# EAGLE design drivessop (EAGLE 6.6.0)
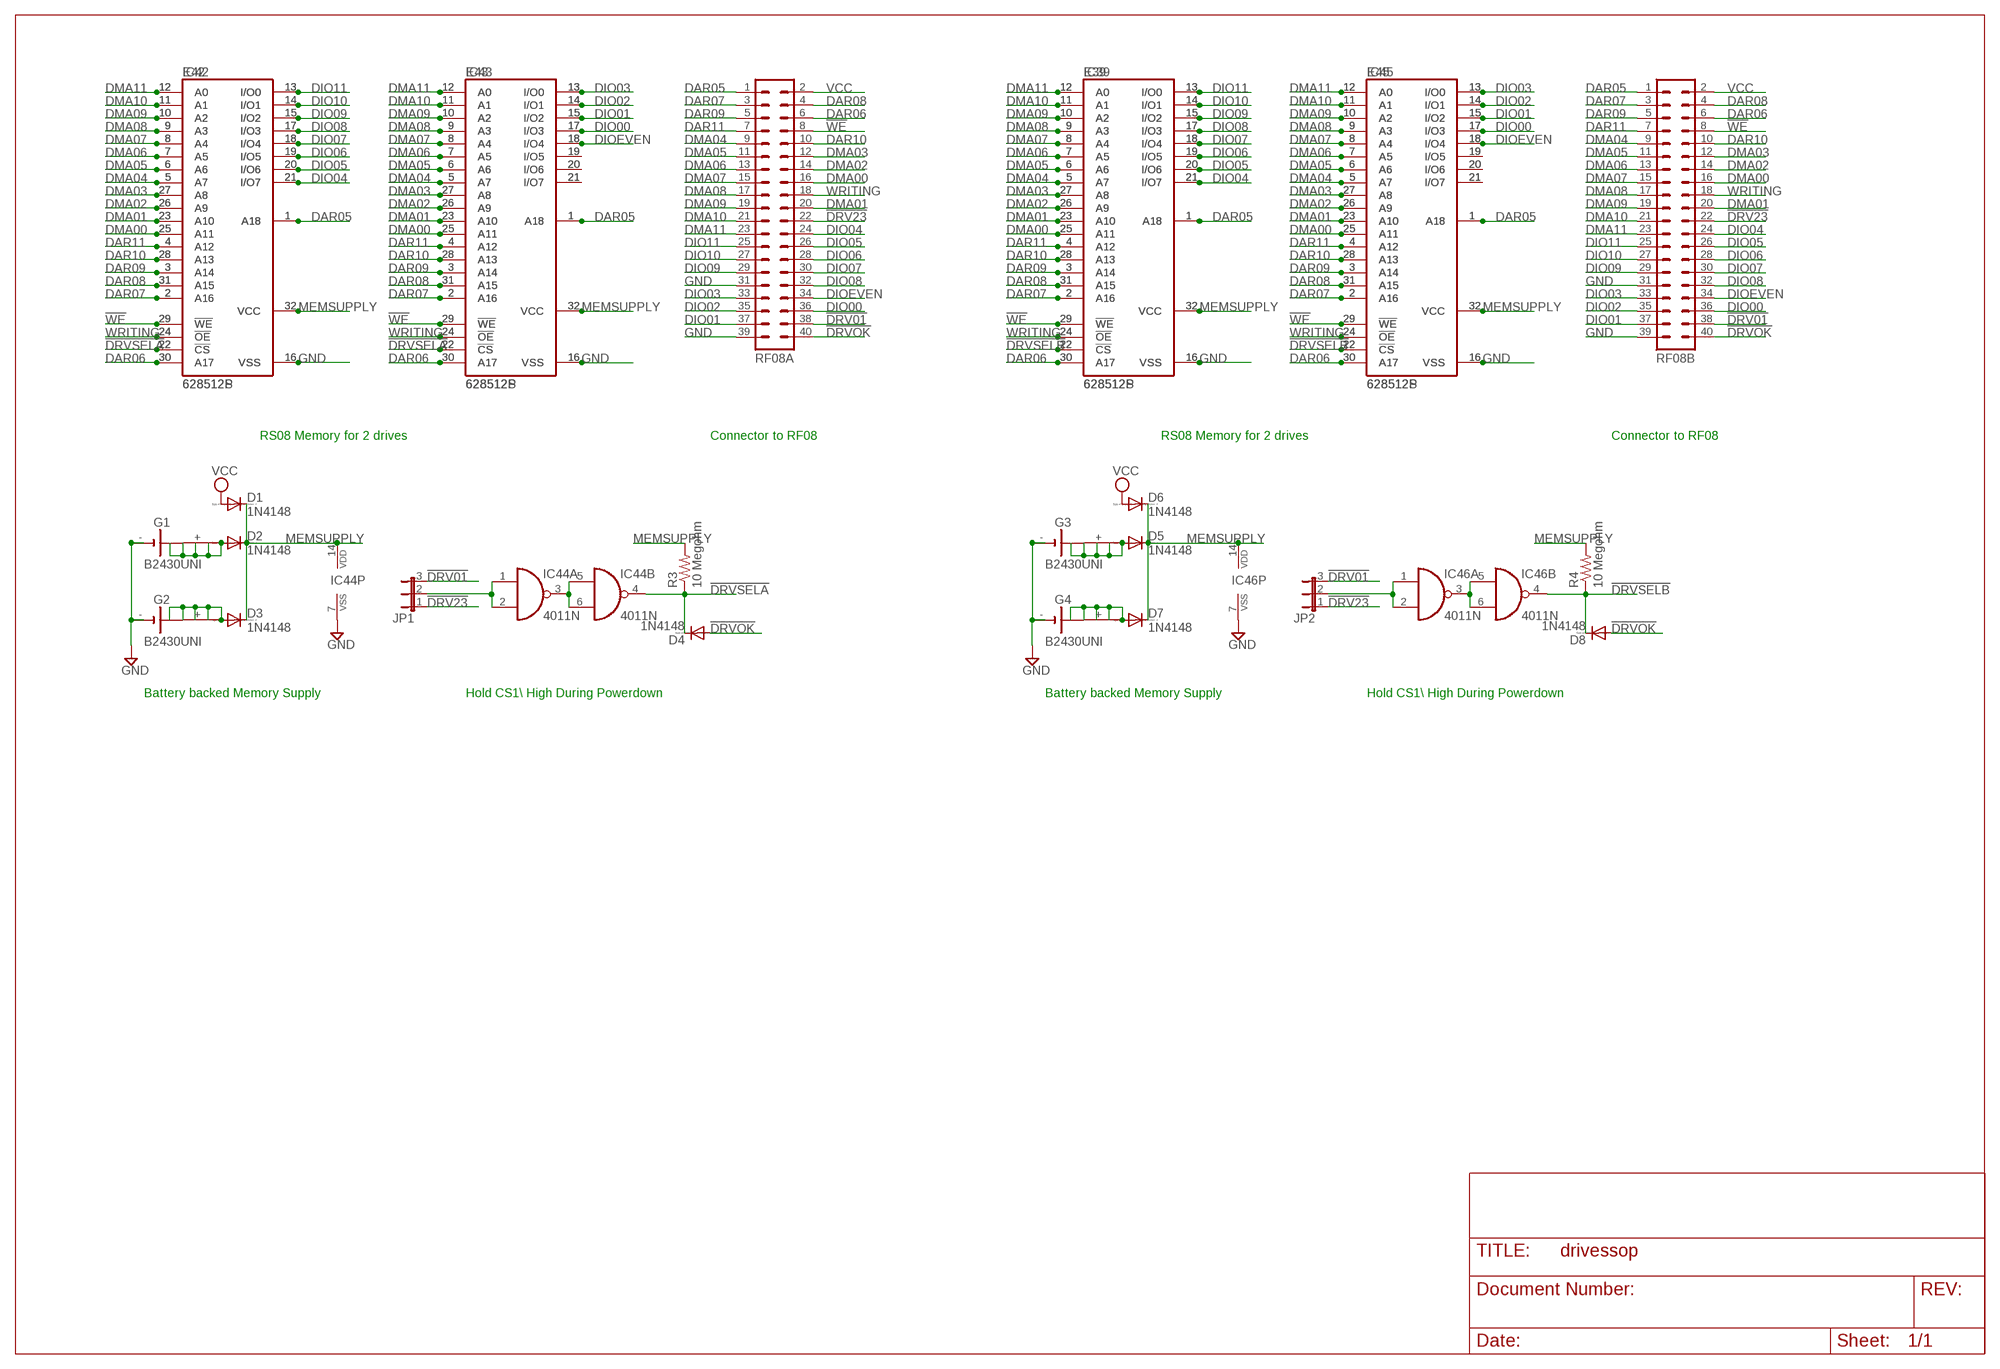
[diagram p0: schematic, sheet 1]

## Parts
D1  1N4148  1N4148DO35-10  [DO35-10]
D2  1N4148  1N4148DO35-10  [DO35-10]
D3  1N4148  1N4148DO35-10  [DO35-10]
D4  1N4148  1N4148DO35-10  [DO35-10]
D5  1N4148  1N4148DO35-10  [DO35-10]
D6  1N4148  1N4148DO35-10  [DO35-10]
D7  1N4148  1N4148DO35-10  [DO35-10]
D8  1N4148  1N4148DO35-10  [DO35-10]
E39  628512S  [S032L]
E42  628512S  [S032L]
E43  628512S  [S032L]
E45  628512S  [S032L]
G1  B2430UNI  [B2430UNI]
G2  B2430UNI  [B2430UNI]
G3  B2430UNI  [B2430UNI]
G4  B2430UNI  [B2430UNI]
IC39  628512P  [DIL32]
IC42  628512P  [DIL32]
IC43  628512P  [DIL32]
IC44  4011N  [DIL14]
IC45  628512P  [DIL32]
IC46  4011N  [DIL14]
JP1  JP2E  [JP2]
JP2  JP2E  [JP2]
R3  10 Megohm  R-US_0207/10  [0207/10]
R4  10 Megohm  R-US_0207/10  [0207/10]
RF08A  MA20-2  [MA20-2]
RF08B  MA20-2  [MA20-2]

## Nets
!DRV01: JP1.3 JP2.3 RF08A.38 RF08B.38
!DRV23: JP1.1 JP2.1 RF08A.22 RF08B.22
!DRVOK: D4.A D8.A RF08A.40 RF08B.40
!DRVSELA: D4.C E42.22(!CS) E43.22(!CS) IC42.22(!CS) IC43.22(!CS) IC44.4(B:O) R3.1
!DRVSELB: D8.C E39.22(!CS) E45.22(!CS) IC39.22(!CS) IC45.22(!CS) IC46.4(B:O) R4.1
!WE: E39.29(!WE) E42.29(!WE) E43.29(!WE) E45.29(!WE) IC39.29(!WE) IC42.29(!WE) IC43.29(!WE) IC45.29(!WE) RF08A.8 RF08B.8
DAR05: E39.1(A18) E42.1(A18) E43.1(A18) E45.1(A18) IC39.1(A18) IC42.1(A18) IC43.1(A18) IC45.1(A18) RF08A.1 RF08B.1
DAR06: E39.30(A17) E42.30(A17) E43.30(A17) E45.30(A17) IC39.30(A17) IC42.30(A17) IC43.30(A17) IC45.30(A17) RF08A.6 RF08B.6
DAR07: E39.2(A16) E42.2(A16) E43.2(A16) E45.2(A16) IC39.2(A16) IC42.2(A16) IC43.2(A16) IC45.2(A16) RF08A.3 RF08B.3
DAR08: E39.31(A15) E42.31(A15) E43.31(A15) E45.31(A15) IC39.31(A15) IC42.31(A15) IC43.31(A15) IC45.31(A15) RF08A.4 RF08B.4
DAR09: E39.3(A14) E42.3(A14) E43.3(A14) E45.3(A14) IC39.3(A14) IC42.3(A14) IC43.3(A14) IC45.3(A14) RF08A.5 RF08B.5
DAR10: E39.28(A13) E42.28(A13) E43.28(A13) E45.28(A13) IC39.28(A13) IC42.28(A13) IC43.28(A13) IC45.28(A13) RF08A.10 RF08B.10
DAR11: E39.4(A12) E42.4(A12) E43.4(A12) E45.4(A12) IC39.4(A12) IC42.4(A12) IC43.4(A12) IC45.4(A12) RF08A.7 RF08B.7
DIO00: E43.17(I/O3) E45.17(I/O3) IC43.17(I/O3) IC45.17(I/O3) RF08A.36 RF08B.36
DIO01: E43.15(I/O2) E45.15(I/O2) IC43.15(I/O2) IC45.15(I/O2) RF08A.37 RF08B.37
DIO02: E43.14(I/O1) E45.14(I/O1) IC43.14(I/O1) IC45.14(I/O1) RF08A.35 RF08B.35
DIO03: E43.13(I/O0) E45.13(I/O0) IC43.13(I/O0) IC45.13(I/O0) RF08A.33 RF08B.33
DIO04: E39.21(I/O7) E42.21(I/O7) IC39.21(I/O7) IC42.21(I/O7) RF08A.24 RF08B.24
DIO05: E39.20(I/O6) E42.20(I/O6) IC39.20(I/O6) IC42.20(I/O6) RF08A.26 RF08B.26
DIO06: E39.19(I/O5) E42.19(I/O5) IC39.19(I/O5) IC42.19(I/O5) RF08A.28 RF08B.28
DIO07: E39.18(I/O4) E42.18(I/O4) IC39.18(I/O4) IC42.18(I/O4) RF08A.30 RF08B.30
DIO08: E39.17(I/O3) E42.17(I/O3) IC39.17(I/O3) IC42.17(I/O3) RF08A.32 RF08B.32
DIO09: E39.15(I/O2) E42.15(I/O2) IC39.15(I/O2) IC42.15(I/O2) RF08A.29 RF08B.29
DIO10: E39.14(I/O1) E42.14(I/O1) IC39.14(I/O1) IC42.14(I/O1) RF08A.27 RF08B.27
DIO11: E39.13(I/O0) E42.13(I/O0) IC39.13(I/O0) IC42.13(I/O0) RF08A.25 RF08B.25
DIOEVEN: E43.18(I/O4) E45.18(I/O4) IC43.18(I/O4) IC45.18(I/O4) RF08A.34 RF08B.34
DMA00: E39.25(A11) E42.25(A11) E43.25(A11) E45.25(A11) IC39.25(A11) IC42.25(A11) IC43.25(A11) IC45.25(A11) RF08A.16 RF08B.16
DMA01: E39.23(A10) E42.23(A10) E43.23(A10) E45.23(A10) IC39.23(A10) IC42.23(A10) IC43.23(A10) IC45.23(A10) RF08A.20 RF08B.20
DMA02: E39.26(A9) E42.26(A9) E43.26(A9) E45.26(A9) IC39.26(A9) IC42.26(A9) IC43.26(A9) IC45.26(A9) RF08A.14 RF08B.14
DMA03: E39.27(A8) E42.27(A8) E43.27(A8) E45.27(A8) IC39.27(A8) IC42.27(A8) IC43.27(A8) IC45.27(A8) RF08A.12 RF08B.12
DMA04: E39.5(A7) E42.5(A7) E43.5(A7) E45.5(A7) IC39.5(A7) IC42.5(A7) IC43.5(A7) IC45.5(A7) RF08A.9 RF08B.9
DMA05: E39.6(A6) E42.6(A6) E43.6(A6) E45.6(A6) IC39.6(A6) IC42.6(A6) IC43.6(A6) IC45.6(A6) RF08A.11 RF08B.11
DMA06: E39.7(A5) E42.7(A5) E43.7(A5) E45.7(A5) IC39.7(A5) IC42.7(A5) IC43.7(A5) IC45.7(A5) RF08A.13 RF08B.13
DMA07: E39.8(A4) E42.8(A4) E43.8(A4) E45.8(A4) IC39.8(A4) IC42.8(A4) IC43.8(A4) IC45.8(A4) RF08A.15 RF08B.15
DMA08: E39.9(A3) E42.9(A3) E43.9(A3) E45.9(A3) IC39.9(A3) IC42.9(A3) IC43.9(A3) IC45.9(A3) RF08A.17 RF08B.17
DMA09: E39.10(A2) E42.10(A2) E43.10(A2) E45.10(A2) IC39.10(A2) IC42.10(A2) IC43.10(A2) IC45.10(A2) RF08A.19 RF08B.19
DMA10: E39.11(A1) E42.11(A1) E43.11(A1) E45.11(A1) IC39.11(A1) IC42.11(A1) IC43.11(A1) IC45.11(A1) RF08A.21 RF08B.21
DMA11: E39.12(A0) E42.12(A0) E43.12(A0) E45.12(A0) IC39.12(A0) IC42.12(A0) IC43.12(A0) IC45.12(A0) RF08A.23 RF08B.23
GND: E39.16(VSS) E42.16(VSS) E43.16(VSS) E45.16(VSS) G1.- G1.-@1(-) G2.- G2.-@1(-) G3.- G3.-@1(-) G4.- G4.-@1(-) IC39.16(VSS) IC42.16(VSS) IC43.16(VSS) IC44.7(P:VSS) IC45.16(VSS) IC46.7(P:VSS) RF08A.31 RF08A.39 RF08B.31 RF08B.39
MEMSUPPLY [Power]: D1.C D2.C D3.C D5.C D6.C D7.C E39.32(VCC) E42.32(VCC) E43.32(VCC) E45.32(VCC) IC39.32(VCC) IC42.32(VCC) IC43.32(VCC) IC44.14(P:VDD) IC45.32(VCC) IC46.14(P:VDD) R3.2 R4.2
N$1: E43.19(I/O5) IC43.19(I/O5)
N$2: E43.20(I/O6) IC43.20(I/O6)
N$3: E43.21(I/O7) IC43.21(I/O7)
N$4: E45.19(I/O5) IC45.19(I/O5)
N$5: E45.20(I/O6) IC45.20(I/O6)
N$6: E45.21(I/O7) IC45.21(I/O7)
N$18: IC44.3(A:O) IC44.5(B:I0) IC44.6(B:I1)
N$35: IC44.1(A:I0) IC44.2(A:I1) JP1.2
N$36: D7.A G4.+ G4.+@1(+) G4.+@2(+) G4.+@3(+) G4.+@4(+)
N$38: IC46.3(A:O) IC46.5(B:I0) IC46.6(B:I1)
N$39: IC46.1(A:I0) IC46.2(A:I1) JP2.2
N$41: D5.A G3.+ G3.+@1(+) G3.+@2(+) G3.+@3(+) G3.+@4(+)
N$130: D3.A G2.+ G2.+@1(+) G2.+@2(+) G2.+@3(+) G2.+@4(+)
N$131: D2.A G1.+ G1.+@1(+) G1.+@2(+) G1.+@3(+) G1.+@4(+)
VCC [Power]: D1.A D6.A RF08A.2 RF08B.2
WRITING: E39.24(!OE) E42.24(!OE) E43.24(!OE) E45.24(!OE) IC39.24(!OE) IC42.24(!OE) IC43.24(!OE) IC45.24(!OE) RF08A.18 RF08B.18
Unconnected: IC44.8(C:I0) IC44.9(C:I1) IC44.10(C:O) IC44.11(D:O) IC44.12(D:I0) IC44.13(D:I1) IC46.8(C:I0) IC46.9(C:I1) IC46.10(C:O) IC46.11(D:O) IC46.12(D:I0) IC46.13(D:I1)

## Notes on the sheet
- RS08 Memory for 2 drives | Connector to RF08 | RS08 Memory for 2 drives | Connector to RF08
- Battery backed Memory Supply | Hold CS1\\ High During Powerdown | Battery backed Memory Supply | Hold CS1\\ High During Powerdown

## Library data of the parts
D1-D8 = diode:1N4148: DIODE high speed (Philips)
E39 E42 E43 E45 = dec-con:628512S: 512Kx8 Static RAM
G1-G4 = battery:B2430UNI: LI BATTERY
IC39 IC42 IC43 IC45 = dec-con:628512P: 512Kx8 Static RAM
IC44 IC46 = 40xx:4011: Quad 2-input NAND
JP1 JP2 = jumper:JP2E: JUMPER
R3 R4 = rcl:R-US_: RESISTOR, American symbol
RF08A RF08B = con-lstb:MA20-2: PIN HEADER; OC_FARNELL: unknown; OC_NEWARK: unknown

## Net classes
1 Power: width 0.508 mm

## Board
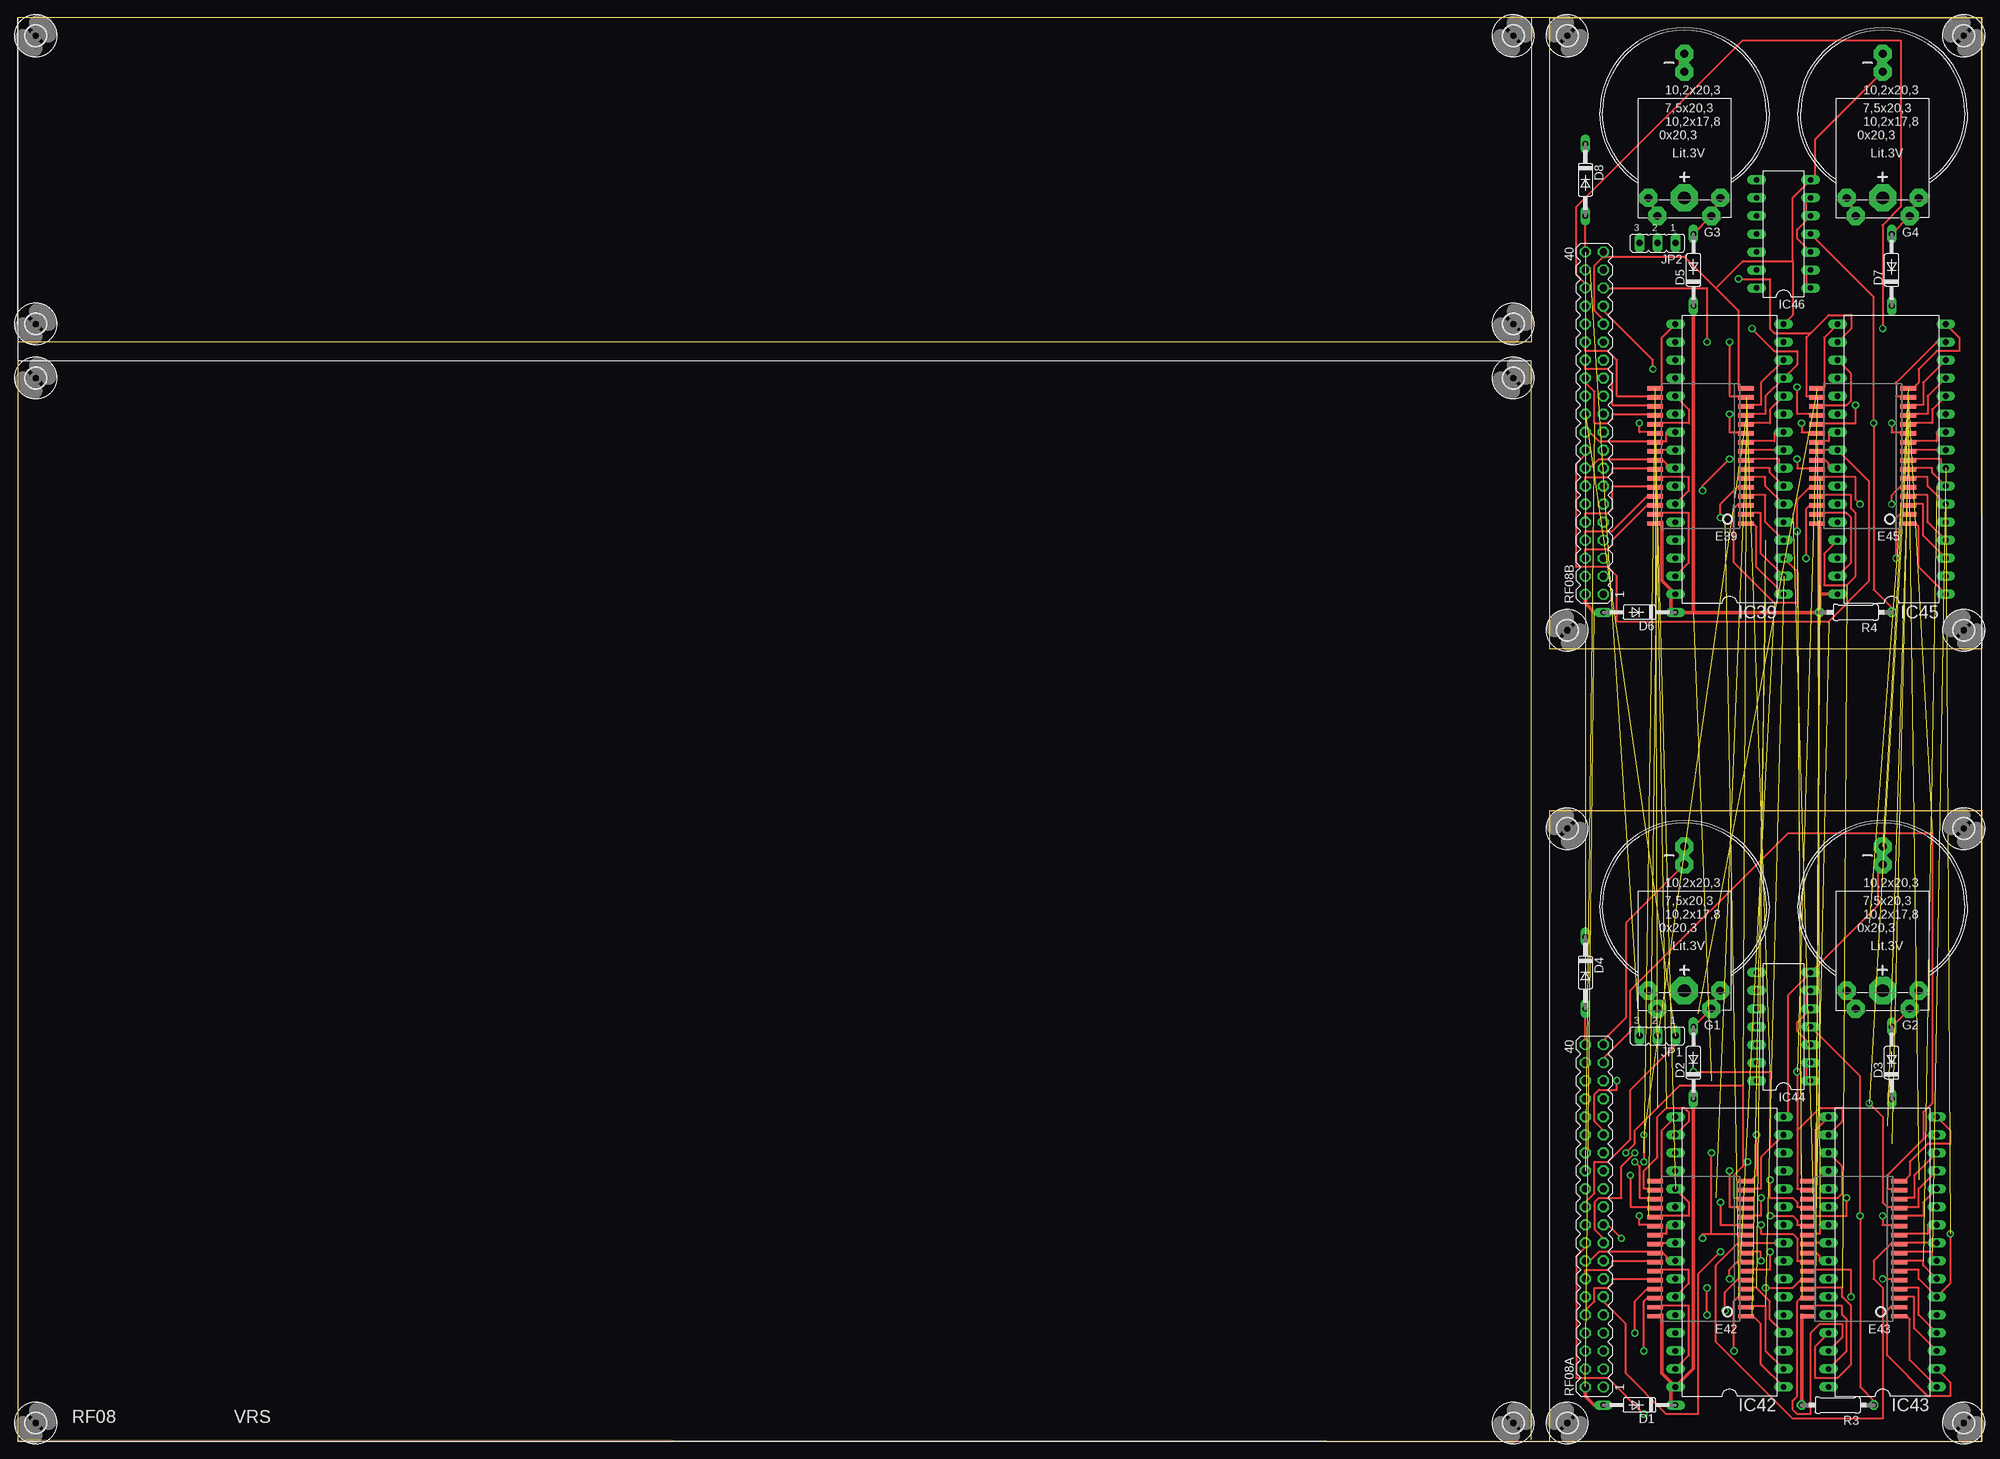
[diagram p1: board, top side]
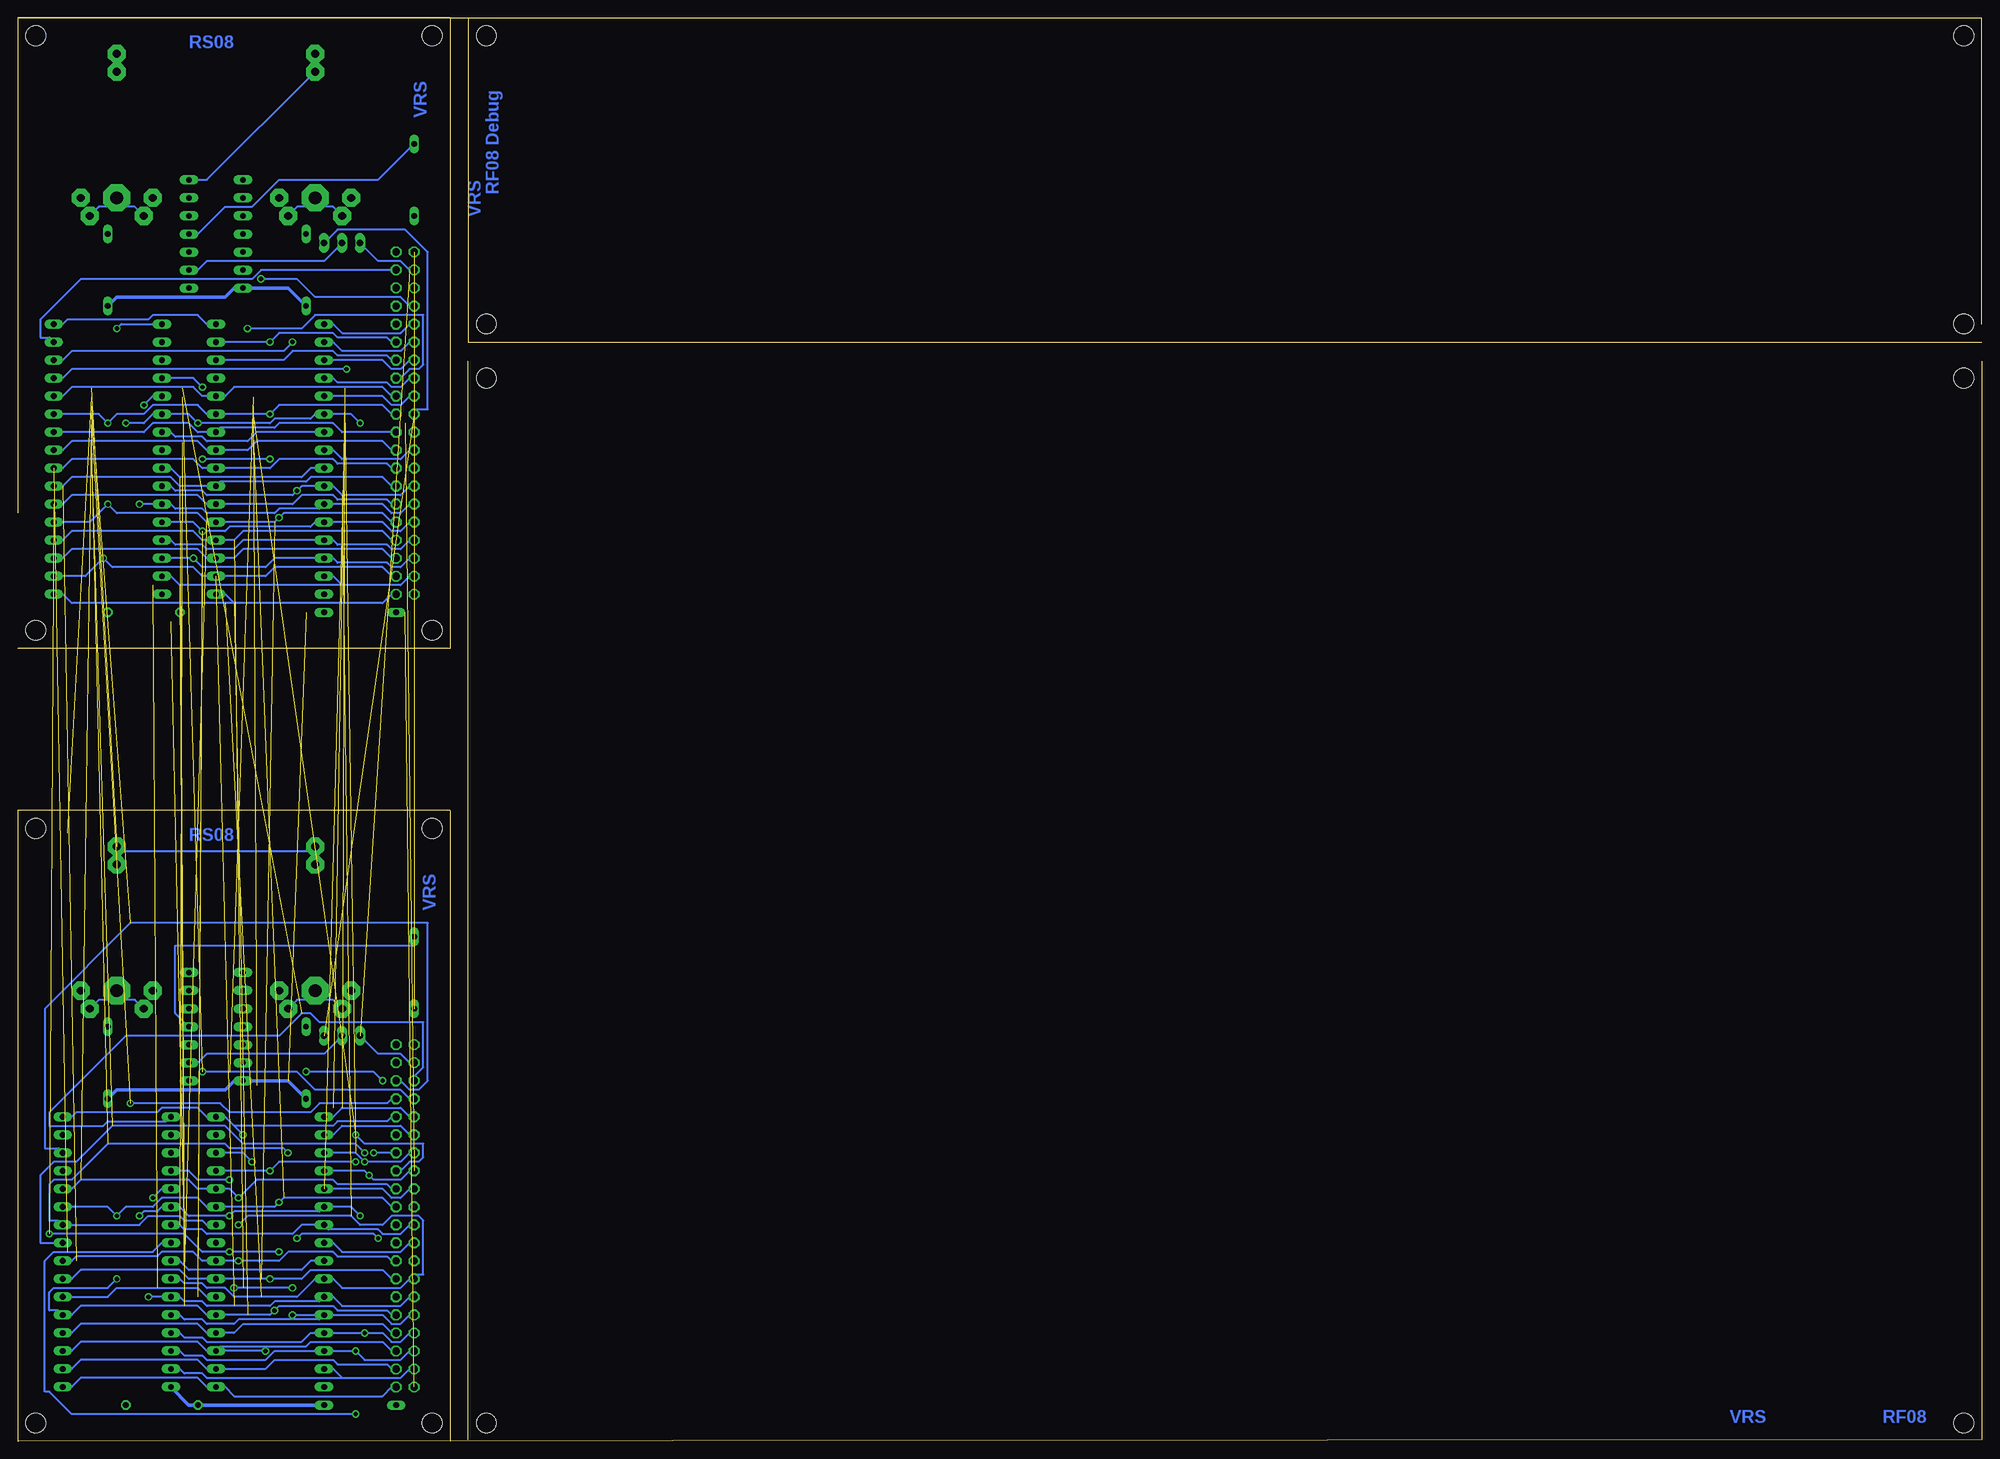
[diagram p2: board, bottom side, seen from below]

Size 276.86 x 200.67 mm. Coordinates in mm from the lower left corner, seen from the top.
Outline: 276.69,0 0.01,0.18 0.01,152.25
Outline: 213.34,0.18 213.34,152.25
Outline: 215.9,0.01 215.9,88.92 276.86,88.92 276.86,0.01
Outline: 276.86,111.78 215.9,111.78 215.9,200.67 276.86,200.67
Outline: 276.86,200.67 0,200.67 0,157.49
Outline: 276.86,200.67 276.86,130.82
Outline: 0,154.95 213.36,154.95 213.36,200.67
Copper layers (1*16): Top 0.035mm / dielectric 1.5mm / Bottom 0.035mm
Design rules "olimex10mil": minimum track width 10mil, minimum drill 24mil, track to track 10mil, track to pad 10mil, pad to pad 10mil, via to via 10mil, smd to smd 10mil, copper to edge 40mil, drill to drill 10mil, minimum pad ring 10mil, minimum via ring 8mil, stop-mask expansion 0mil, vias tented up to drill 0mil, thermal gap 10mil

### Footprints (pad centres in the part's own frame; a part is rotated, then mirrored left to right if it is on the bottom)
DO35-10 = drill 0.813 long: A 5.08,0; C -5.08,0
S032L = smd 0.6 x 2.2: 1 -7.795,-6.146; 2 -6.525,-6.146; 3 -5.255,-6.146; 4 -3.985,-6.146; 5 -2.715,-6.146; 6 -1.445,-6.146; 7 -0.175,-6.146; 8 1.095,-6.146; 9 2.365,-6.146; 10 3.635,-6.146; 11 4.905,-6.146; 12 6.175,-6.146; 13 7.445,-6.146; 14 8.715,-6.146; 15 9.985,-6.146; 16 11.255,-6.146; 17 11.255,6.686; 18 9.985,6.686; 19 8.715,6.686; 20 7.445,6.686; 21 6.175,6.686; 22 4.905,6.686; 23 3.635,6.686; 24 2.365,6.686; 25 1.095,6.686; 26 -0.175,6.686; 27 -1.445,6.686; 28 -2.715,6.686; 29 -3.985,6.686; 30 -5.255,6.686; 31 -6.525,6.686; 32 -7.795,6.686
B2430UNI = drill 1.118 pad 2.54 octagon: + 3.81,14.605; +@1 -3.81,14.605; +@2 -5.08,12.065; +@3 5.08,12.065; - 0,-5.715; -@1 0,-8.255 | drill 1.803 pad 3.81 octagon: +@4 0,12.065
DIL32 = drill 0.813 long: 1 -19.05,-7.62; 2 -16.51,-7.62; 3 -13.97,-7.62; 4 -11.43,-7.62; 5 -8.89,-7.62; 6 -6.35,-7.62; 7 -3.81,-7.62; 8 -1.27,-7.62; 9 1.27,-7.62; 10 3.81,-7.62; 11 6.35,-7.62; 12 8.89,-7.62; 13 11.43,-7.62; 14 13.97,-7.62; 15 16.51,-7.62; 16 19.05,-7.62; 17 19.05,7.62; 18 16.51,7.62; 19 13.97,7.62; 20 11.43,7.62; 21 8.89,7.62; 22 6.35,7.62; 23 3.81,7.62; 24 1.27,7.62; 25 -1.27,7.62; 26 -3.81,7.62; 27 -6.35,7.62; 28 -8.89,7.62; 29 -11.43,7.62; 30 -13.97,7.62; 31 -16.51,7.62; 32 -19.05,7.62
DIL14 = drill 0.813 long: 1 -7.62,-3.81; 2 -5.08,-3.81; 3 -2.54,-3.81; 4 0,-3.81; 5 2.54,-3.81; 6 5.08,-3.81; 7 7.62,-3.81; 8 7.62,3.81; 9 5.08,3.81; 10 2.54,3.81; 11 0,3.81; 12 -2.54,3.81; 13 -5.08,3.81; 14 -7.62,3.81
JP2 = drill 0.914 long: 1 -2.54,0; 2 0,0; 3 2.54,0
0207/10 = drill 0.813 octagon: 1 -5.08,0; 2 5.08,0
MA20-2 = drill 1.016 octagon: 1 -24.13,-1.27; 2 -24.13,1.27; 3 -21.59,-1.27; 4 -21.59,1.27; 5 -19.05,-1.27; 6 -19.05,1.27; 7 -16.51,-1.27; 8 -16.51,1.27; 9 -13.97,-1.27; 10 -13.97,1.27; 11 -11.43,-1.27; 12 -11.43,1.27; 13 -8.89,-1.27; 14 -8.89,1.27; 15 -6.35,-1.27; 16 -6.35,1.27; 17 -3.81,-1.27; 18 -3.81,1.27; 19 -1.27,-1.27; 20 -1.27,1.27; 21 1.27,-1.27; 22 1.27,1.27; 23 3.81,-1.27; 24 3.81,1.27; 25 6.35,-1.27; 26 6.35,1.27; 27 8.89,-1.27; 28 8.89,1.27; 29 11.43,-1.27; 30 11.43,1.27; 31 13.97,-1.27; 32 13.97,1.27; 33 16.51,-1.27; 34 16.51,1.27; 35 19.05,-1.27; 36 19.05,1.27; 37 21.59,-1.27; 38 21.59,1.27; 39 24.13,-1.27; 40 24.13,1.27
2,8 = hole 2.8: 0,0

### Placement (x,y rotation side)
D1  228.6,5.09 180 top
D2  236.22,53.36 90 top
D3  264.16,53.36 90 top
D4  220.98,66.06 270 top
D5  236.22,165.11 90 top
D6  228.6,116.86 180 top
D7  264.16,165.11 90 top
D8  220.98,177.81 270 top
E39  237.49,137.17 90 top
E42  237.49,25.41 90 top
E43  259.08,25.41 90 top
E45  260.35,137.17 90 top
G1  234.95,75.58 180 top
G2  262.89,75.58 180 top
G3  234.95,187.34 180 top
G4  262.89,187.34 180 top
IC39  241.3,138.44 90 top
IC42  241.3,26.69 90 top
IC43  262.89,26.69 90 top
IC44  248.92,58.44 90 top
IC45  264.16,138.44 90 top
IC46  248.92,170.19 90 top
JP1  231.14,57.16 180 top
JP2  231.14,168.92 180 top
R3  256.54,5.09 180 top
R4  259.08,116.86 180 top
RF08A  222.25,31.77 90 top
RF08B  222.25,143.52 90 top
U$1  [2,8]  2.54,149.88 0 top
U$2  [2,8]  210.82,149.88 0 top
U$3  [2,8]  2.54,2.56 0 top
U$4  [2,8]  210.82,2.56 0 top
U$5  [2,8]  274.32,2.56 90 top
U$6  [2,8]  218.44,2.56 90 top
U$7  [2,8]  218.44,86.38 90 top
U$8  [2,8]  274.32,86.38 90 top
U$9  [2,8]  274.32,198.13 90 top
U$10  [2,8]  274.32,114.31 90 top
U$11  [2,8]  218.44,114.31 90 top
U$12  [2,8]  218.44,198.13 90 top
U$13  [2,8]  2.54,157.49 0 top
U$14  [2,8]  2.54,198.13 0 top
U$16  [2,8]  210.82,157.49 0 top
U$17  [2,8]  210.82,198.13 0 top
U$18  [SIERRA-PROTO]  0,0.01 0 top

### Tracks (layer width: path | path; a pad name or v marks a point on that pad's centre or on a via)
!DRV01  (1 unrouted)
  Bottom 0.254: JP1.3 226.06,54.62 222.88,54.62 221.62,53.36 RF08A.38 | JP2.3 226.06,166.38 222.88,166.38 221.62,165.11 RF08B.38
!DRV23  (1 unrouted)
  Top 0.254: JP1.1 233.68,55.9 227.33,49.55 227.33,42.56 224.16,39.38 222.25,39.38 222.25,34.94 220.98,33.67 RF08A.22
  Bottom 0.254: JP2.1 231.78,170.83 222.25,170.83 219.07,167.65 219.07,145.43 220.98,145.43 RF08B.22
!DRVOK  (1 unrouted)
  Top 0.254: RF08A.40 D4.A | RF08B.40 D8.A
!DRVSELA  (via drill 0.61)
  Top 0.254: v228.6,31.77 228.6,30.5 229.87,30.5 E42.22 | v247.01,31.77 250.19,31.77 250.82,31.13 250.82,30.5 251.46,30.5 E43.22 | R3.1 261.62,5.73 259.71,7.63 v259.71,31.77 259.71,51.45 IC44.4
  Bottom 0.254: v228.6,31.77 229.87,33.04 IC42.22 234.31,32.4 246.38,32.4 v247.01,31.77 252.73,31.77 254,33.04 IC43.22 256.54,33.04 257.18,32.4 259.08,32.4 v259.71,31.77 | IC44.4 254.63,60.34 254.63,69.86 220.98,69.86 D4.C
!DRVSELB  (via drill 0.61)
  Top 0.254: v228.6,143.52 228.6,142.25 229.87,142.25 E39.22 | v251.46,143.52 251.46,142.25 252.73,142.25 E45.22 | R4.1 264.16,117.49 261.62,120.03 v261.62,143.52 261.62,161.3 IC46.4
  Bottom 0.254: v228.6,143.52 229.87,144.79 IC39.22 234.95,144.79 235.59,144.16 240.66,144.16 241.3,143.52 v251.46,143.52 252.73,144.79 IC45.22 257.81,144.79 259.08,143.52 v261.62,143.52 | D8.C 226.06,177.81 240.03,177.81 243.84,174 247.65,174 251.46,170.19 IC46.4
!WE  (via drill 0.61)  (1 unrouted)
  Top 0.254: E43.29 253.37,21.61 257.18,21.61 257.18,20.34 258.44,19.07 258.44,10.81 256.54,8.91 253.37,8.91 253.37,13.35 IC43.29 | v227.97,15.26 227.97,19.7 229.87,21.61 E42.29 | E45.29 254.63,133.36 258.44,133.36 258.44,131.46 259.08,130.82 259.08,121.94 257.81,120.67 254.63,120.67 254.63,125.11 IC45.29 | E39.29 229.87,133.36 224.79,128.28 220.98,128.28 RF08B.8
  Bottom 0.254: RF08A.8 221.62,15.26 222.88,13.99 224.16,13.99 225.43,15.26 v227.97,15.26 IC42.29 235.59,15.26 236.85,13.99 250.19,13.99 250.82,14.62 253.37,14.62 254,15.26 IC43.29 | RF08B.8 221.62,127.02 222.88,125.75 224.16,125.75 224.79,126.38 231.78,126.38 232.41,127.02 IC39.29 245.11,127.02 246.38,125.75 250.19,125.75 250.82,126.38 254.63,126.38 255.27,127.02 IC45.29
DAR05  (1 unrouted)
  Top 0.254: E43.1 266.06,17.8 266.7,17.16 266.7,11.45 IC43.1 | E42.1 244.47,17.8 245.75,16.53 245.75,10.81 IC42.1 | E45.1 267.33,129.55 267.97,128.92 267.97,123.2 IC45.1 | E39.1 244.47,129.55 245.11,128.92 245.11,123.2 IC39.1
  Bottom 0.254: RF08A.1 224.16,7.63 225.43,6.36 246.38,6.36 247.65,7.63 IC42.1 250.19,7.63 251.46,8.91 267.97,8.91 269.24,7.63 IC43.1 | 246.38,118.12 225.43,118.12 224.16,119.39 RF08B.1 | 246.38,118.12 247.65,119.39 IC39.1 | 246.38,118.12 269.24,118.12 270.51,119.39 IC45.1
DAR06  (via drill 0.61)  (1 unrouted)
  Top 0.254: E43.30 251.46,20.34 250.82,19.7 250.82,6.36 250.19,5.73 250.19,4.46 250.82,3.83 252.73,3.83 252.73,15.26 254,16.53 257.18,16.53 257.18,14.62 IC43.30 | v229.24,12.71 229.24,19.7 229.87,20.34 E42.30 | v252.09,124.47 252.09,131.46 252.73,132.09 E45.30 | E39.30 229.87,132.09 224.79,127.02 224.79,126.38 224.16,125.75 220.98,125.75 RF08B.6
  Bottom 0.254: RF08A.6 221.62,12.71 222.88,11.45 227.97,11.45 v229.24,12.71 IC42.30 240.66,12.71 241.94,11.45 250.19,11.45 250.82,12.08 253.37,12.08 254,12.71 IC43.30 | IC45.30 v252.09,124.47 250.82,123.2 241.94,123.2 240.66,124.47 IC39.30 232.41,124.47 231.78,123.84 224.79,123.84 224.16,123.2 222.88,123.2 221.62,124.47 RF08B.6
DAR07  (via drill 0.61)  (1 unrouted)
  Top 0.254: E43.2 264.16,19.07 263.52,18.43 263.52,12.08 269.24,6.36 272.42,6.36 272.42,8.27 IC43.2 | E42.2 244.47,19.07 246.38,19.07 246.38,12.71 IC42.2 | v264.8,124.47 264.8,130.19 265.43,130.82 E45.2 | E39.2 244.47,130.82 245.75,130.82 245.75,125.11 IC39.2
  Bottom 0.254: RF08A.3 224.16,10.18 224.79,10.81 231.78,10.81 232.41,11.45 240.66,11.45 241.94,10.18 IC42.2 250.19,10.18 251.46,11.45 267.97,11.45 269.24,10.18 IC43.2 | IC45.2 267.33,121.94 v264.8,124.47 263.52,123.2 252.09,123.2 250.82,121.94 IC39.2 241.94,121.94 240.66,123.2 225.43,123.2 224.16,121.94 RF08B.3
DAR08  (1 unrouted)
  Top 0.254: E43.31 253.37,19.07 257.18,19.07 257.18,17.8 257.81,17.16 257.81,12.71 IC43.31 | E42.31 231.78,19.07 235.59,19.07 235.59,12.08 IC42.31 | E45.31 254.63,130.82 257.81,130.82 258.44,130.19 258.44,123.84 IC45.31 | E39.31 231.78,130.82 235.59,130.82 235.59,123.84 IC39.31
  Bottom 0.254: 231.14,8.91 222.88,8.91 221.62,10.18 RF08A.4 | 231.14,8.91 232.41,10.18 IC42.31 | 231.14,8.91 250.19,8.91 250.82,9.54 253.37,9.54 254,10.18 IC43.31 | 231.14,120.67 222.88,120.67 221.62,121.94 RF08B.4 | 231.14,120.67 232.41,121.94 IC39.31 | 231.14,120.67 254,120.67 255.27,121.94 IC45.31
DAR09  (via drill 0.61)  (1 unrouted)
  Top 0.254: E43.3 266.06,20.34 267.33,20.34 267.33,15.89 IC43.3 | v241.94,12.71 241.94,19.7 242.57,20.34 E42.3 | E45.3 267.33,132.09 268.61,132.09 268.61,127.65 IC45.3 | E39.3 242.57,132.09 241.94,131.46 241.94,123.84 247.65,118.12 250.82,118.12 250.82,122.57 IC39.3
  Bottom 0.254: v241.94,12.71 IC42.3 | RF08A.5 224.16,12.71 225.43,13.99 235.59,13.99 236.22,13.35 248.28,13.35 IC42.3 | IC43.3 269.24,12.71 267.97,13.99 251.46,13.99 250.19,12.71 IC42.3 | RF08B.5 224.16,124.47 225.43,125.75 245.11,125.75 246.38,124.47 IC39.3 250.19,124.47 251.46,125.75 269.24,125.75 270.51,124.47 IC45.3
DAR10  (via drill 0.61)  (1 unrouted)
  Top 0.254: E42.28 229.87,22.88 224.79,22.88 224.79,22.24 224.16,21.61 222.25,21.61 222.25,19.7 220.98,18.43 RF08A.10 | v246.38,21.61 250.19,21.61 251.46,22.88 E43.28 | v238.12,17.8 v238.12,21.61 | E39.28 229.87,134.63 224.79,134.63 224.79,131.46 224.16,130.82 220.98,130.82 RF08B.10 | v250.82,128.28 250.82,132.73 252.73,134.63 E45.28
  Bottom 0.254: v238.12,21.61 v246.38,21.61 | v238.12,17.8 IC42.28 | IC43.28 254,17.8 253.37,17.16 250.82,17.16 250.19,16.53 246.38,16.53 245.75,17.16 234.31,17.16 IC42.28 | RF08A.10 221.62,17.8 222.88,16.53 224.16,16.53 225.43,17.8 IC42.28 | IC45.28 252.09,129.55 v250.82,128.28 247.65,128.28 247.01,128.92 235.59,128.92 234.95,129.55 IC39.28 225.43,129.55 224.16,128.28 222.88,128.28 221.62,129.55 RF08B.10
DAR11  (1 unrouted)
  Top 0.254: E45.4 267.33,133.36 269.24,133.36 269.24,129.55 IC45.4 | E39.4 244.47,133.36 246.38,133.36 246.38,129.55 IC39.4 | E43.4 266.06,21.61 267.97,21.61 267.97,17.8 IC43.4 | E42.4 244.47,21.61 245.11,21.61 247.01,19.7 247.01,17.16 IC42.4
  Bottom 0.254: RF08B.7 224.16,127.02 225.43,128.28 245.11,128.28 246.38,127.02 IC39.4 250.82,127.02 252.09,128.28 269.24,128.28 270.51,127.02 IC45.4 | RF08A.7 224.16,15.26 225.43,16.53 245.11,16.53 246.38,15.26 IC42.4 250.19,15.26 251.46,16.53 267.97,16.53 269.24,15.26 IC43.4
DIO00  (via drill 0.61)  (1 unrouted)
  Top 0.254: E43.17 253.37,36.84 253.37,43.83 IC43.17 | E45.17 254.63,148.6 254.63,155.59 IC45.17 | v262.89,156.86 262.89,171.46 265.43,174 265.43,197.5 243.21,197.5 219.71,174 219.71,164.48 220.98,163.21 RF08B.36
  Bottom 0.254: RF08A.36 220.98,51.45 219.71,52.72 219.71,59.07 234.31,59.07 235.59,60.34 236.85,60.34 240.03,57.16 261.62,57.16 272.42,46.37 272.42,44.47 264.8,44.47 264.16,45.1 255.91,45.1 IC43.17 | v262.89,156.86 262.25,157.49 IC45.17
DIO01  (1 unrouted)
  Top 0.254: 268.61,42.56 269.24,43.2 IC43.15 | 268.61,42.56 263.52,37.48 263.52,35.58 264.16,35.58 E43.15 | 268.61,42.56 268.61,46.37 269.88,47.64 269.88,85.74 249.56,85.74 227.33,63.52 227.33,57.8 223.52,53.99 RF08A.37 | E45.15 265.43,147.33 264.8,147.33 264.8,149.24 270.51,154.95 IC45.15
  Bottom 0.254: RF08B.37 242.57,165.11 243.84,163.84 267.97,163.84 273.69,158.13 273.69,155.59 272.42,155.59 IC45.15
DIO02  (via drill 0.61)  (1 unrouted)
  Top 0.254: E43.14 266.06,34.3 267.33,34.3 267.33,37.48 IC43.14 | E45.14 267.33,146.06 268.61,146.06 268.61,149.24 IC45.14 | v238.12,154.95 238.12,162.57 RF08B.35
  Bottom 0.254: RF08A.35 222.88,50.81 221.62,49.55 220.34,49.55 219.07,50.81 219.07,73.04 260.99,73.04 273.05,60.98 273.05,41.29 271.14,41.29 IC43.14 | v238.12,154.95 239.4,153.68 269.24,153.68 270.51,152.41 IC45.14
DIO03  (via drill 0.61)  (1 unrouted)
  Top 0.254: IC43.13 267.97,35.58 267.97,33.04 266.06,33.04 E43.13 264.16,33.04 263.52,33.04 262.89,33.67 262.89,45.73 v260.99,47.64 | E45.13 267.33,144.79 269.24,144.79 269.24,147.33 IC45.13 | v230.5,151.14 230.5,152.41 223.52,159.4 RF08B.33
  Bottom 0.254: v260.99,47.64 248.28,47.64 247.01,46.37 235.59,46.37 234.31,47.64 224.79,47.64 224.16,48.27 RF08A.33 | v230.5,151.14 269.24,151.14 270.51,149.88 IC45.13
DIO04  (1 unrouted)
  Top 0.254: E42.21 231.78,31.77 235.59,31.77 235.59,33.67 IC42.21 | E39.21 231.78,143.52 235.59,143.52 235.59,145.43 IC39.21
  Bottom 0.254: RF08A.24 221.62,35.58 222.88,34.3 224.16,34.3 225.43,35.58 IC42.21 | RF08B.24 221.62,147.33 222.88,146.06 224.16,146.06 225.43,147.33 IC39.21
DIO05  (via drill 0.61)  (1 unrouted)
  Top 0.254: E39.20 229.87,144.79 224.79,144.79 224.79,144.16 224.16,143.52 222.25,143.52 222.25,147.97 220.98,149.24 RF08B.26 | v227.33,37.48 227.33,33.04 229.87,33.04 E42.20
  Bottom 0.254: IC39.20 232.41,149.88 231.78,149.24 224.79,149.24 224.16,148.6 222.88,148.6 221.62,149.88 RF08B.26 | IC42.20 227.97,38.12 v227.33,37.48 226.69,36.84 222.88,36.84 221.62,38.12 RF08A.26
DIO06  (via drill 0.61)  (1 unrouted)
  Top 0.254: v227.97,39.38 228.6,38.75 228.6,34.3 229.87,34.3 E42.19 | E39.19 229.87,146.06 224.79,146.06 224.79,150.51 224.16,151.14 220.98,151.14 RF08B.28
  Bottom 0.254: IC42.19 229.24,40.66 v227.97,39.38 222.88,39.38 221.62,40.66 RF08A.28 | IC39.19 225.43,152.41 224.16,151.14 222.88,151.14 221.62,152.41 RF08B.28
DIO07  (1 unrouted)
  Top 0.254: E42.18 229.87,35.58 229.24,35.58 229.24,38.12 231.14,40.02 231.14,45.73 232.41,47.01 234.95,47.01 235.59,46.37 235.59,45.1 IC42.18 | E39.18 229.87,147.33 225.43,147.33 225.43,152.41 224.16,153.68 220.98,153.68 RF08B.30
  Bottom 0.254: RF08A.30 221.62,43.2 222.88,44.47 231.14,44.47 232.41,43.2 IC42.18 | IC39.18 232.41,154.95 231.14,153.68 222.88,153.68 221.62,154.95 RF08B.30
DIO08  (1 unrouted)
  Top 0.254: E42.17 231.78,36.84 231.78,43.83 IC42.17 | E39.17 231.78,148.6 231.78,155.59 IC39.17
  Bottom 0.254: RF08A.32 221.62,45.73 222.88,47.01 231.14,47.01 232.41,45.73 IC42.17 | RF08B.32 221.62,157.49 222.88,156.22 231.14,156.22 232.41,157.49 IC39.17
DIO09  (via drill 0.61)  (1 unrouted)
  Top 0.254: 247.01,41.29 245.75,40.02 245.75,35.58 244.47,35.58 E42.15 | 247.01,41.29 IC42.15 | v225.43,50.81 225.43,49.55 222.88,49.55 222.25,48.91 222.25,45.1 223.52,43.83 RF08A.29 | v236.22,52.09 247.01,52.09 247.01,41.29 | v241.3,154.95 241.3,147.33 242.57,147.33 E39.15
  Bottom 0.254: v225.43,50.81 226.69,52.09 v236.22,52.09 | IC39.15 v241.3,154.95 240.03,156.22 232.41,156.22 231.78,155.59 224.79,155.59 224.16,154.95 RF08B.29
DIO10  (via drill 0.61)  (1 unrouted)
  Top 0.254: 243.21,38.75 v243.84,39.38 | 243.21,38.75 241.94,37.48 241.94,34.3 242.57,34.3 E42.14 | v226.69,40.66 227.97,41.92 227.97,43.83 234.31,50.18 243.21,50.18 243.21,38.75 | E39.14 244.47,146.06 245.75,146.06 245.75,149.24 IC39.14
  Bottom 0.254: v243.84,39.38 245.11,40.66 IC42.14 | RF08A.27 v226.69,40.66 | RF08B.27 224.16,152.41 224.79,153.05 231.78,153.05 232.41,153.68 238.12,153.68 239.4,152.41 IC39.14
DIO11  (via drill 0.61)  (1 unrouted)
  Top 0.254: v241.3,38.12 241.3,33.04 242.57,33.04 E42.13 | v229.24,43.2 v229.24,39.38 | E39.13 244.47,144.79 246.38,144.79 246.38,147.33 IC39.13 250.82,151.78 250.82,153.68 247.65,153.68 v244.47,156.86
  Bottom 0.254: IC42.13 v241.3,38.12 240.03,39.38 v229.24,39.38 | v229.24,43.2 227.97,41.92 219.71,41.92 219.71,40.02 220.34,39.38 221.62,39.38 222.88,38.12 RF08A.25 | v244.47,156.86 236.85,156.86 234.95,158.76 219.71,158.76 219.71,151.78 220.34,151.14 221.62,151.14 222.88,149.88 RF08B.25
DIOEVEN  (via drill 0.61)  (1 unrouted)
  Top 0.254: 250.82,43.83 250.82,35.58 251.46,35.58 E43.18 | 250.82,43.83 254,47.01 257.18,47.01 257.18,45.1 IC43.18 | v250.82,52.09 250.82,43.83 | 252.73,156.22 255.27,158.76 258.44,158.76 258.44,156.86 IC45.18 | 252.73,156.22 252.09,155.59 252.09,147.33 252.73,147.33 E45.18 | v242.57,163.84 247.01,163.84 247.01,156.86 247.65,156.22 252.73,156.22
  Bottom 0.254: v250.82,52.09 237.49,52.09 234.95,49.55 222.88,49.55 221.62,48.27 RF08A.34 | v242.57,163.84 237.49,163.84 234.95,161.3 222.88,161.3 221.62,160.03 RF08B.34
DMA00  (1 unrouted)
  Top 0.254: E43.25 253.37,26.69 254,26.05 254,25.41 IC43.25 | IC42.25 232.41,25.41 232.41,26.05 231.78,26.69 E42.25 229.87,26.69 222.88,26.69 221.62,25.41 RF08A.16 | E45.25 254.63,138.44 255.27,137.81 255.27,137.17 IC45.25 | IC39.25 232.41,137.17 232.41,137.81 231.78,138.44 E39.25 229.87,138.44 222.88,138.44 221.62,137.17 RF08B.16
  Bottom 0.254: IC43.25 254,25.41 252.73,24.14 236.85,24.14 235.59,25.41 IC42.25 | IC45.25 255.27,137.17 254,135.9 236.85,135.9 235.59,137.17 IC39.25
DMA01  (1 unrouted)
  Top 0.254: E43.23 253.37,29.23 254,29.23 254,30.5 IC43.23 | E42.23 231.78,29.23 232.41,29.23 232.41,30.5 IC42.23 | E45.23 254.63,140.98 255.27,140.98 255.27,142.25 IC45.23 | IC39.23 232.41,142.25 232.41,140.98 231.78,140.98 E39.23 229.87,140.98 222.88,140.98 221.62,142.25 RF08B.20
  Bottom 0.254: RF08A.20 221.62,30.5 222.88,29.23 225.43,29.23 226.06,29.86 233.04,29.86 IC42.23 236.85,30.5 238.12,29.23 250.19,29.23 250.82,29.86 253.37,29.86 254,30.5 IC43.23 | IC45.23 255.27,142.25 254.63,141.62 250.82,141.62 250.19,140.98 244.47,140.98 243.21,142.25 IC39.23
DMA02  (via drill 0.61)  (1 unrouted)
  Top 0.254: E39.26 229.87,137.17 224.79,137.17 224.79,136.54 224.16,135.9 220.98,135.9 RF08B.14 | v250.82,138.44 250.82,137.17 252.73,137.17 E45.26 | v241.3,138.44 237.49,134.63 v237.49,134 | E42.26 229.87,25.41 224.79,25.41 224.79,24.78 224.16,24.14 220.98,24.14 RF08A.14 | v245.75,30.5 245.75,29.23 250.19,29.23 250.82,28.59 250.82,25.41 251.46,25.41 E43.26
  Bottom 0.254: v241.3,138.44 v250.82,138.44 | IC45.26 255.27,134.63 254.63,134 250.82,134 250.19,133.36 238.12,133.36 v237.49,134 236.85,134.63 IC39.26 232.41,134.63 231.14,133.36 222.88,133.36 221.62,134.63 RF08B.14 | v245.75,30.5 244.47,31.77 229.87,31.77 228.6,30.5 225.43,30.5 224.16,31.77 220.34,31.77 219.71,31.13 219.71,23.51 220.98,23.51 RF08A.14 221.62,22.88 222.88,21.61 231.14,21.61 232.41,22.88 IC42.26 234.95,22.88 237.49,20.34 246.38,20.34 247.65,21.61 250.19,21.61 250.82,22.24 253.37,22.24 254,22.88 IC43.26
DMA03  (via drill 0.61)  (1 unrouted)
  Top 0.254: v258.44,20.34 258.44,24.14 253.37,24.14 E43.27 | E42.27 231.78,24.14 235.59,24.14 235.59,22.24 IC42.27 | v259.71,132.09 259.08,132.73 259.08,135.9 254.63,135.9 E45.27 | E39.27 231.78,135.9 235.59,135.9 235.59,134 IC39.27
  Bottom 0.254: v258.44,20.34 IC43.27 254,20.34 253.37,19.7 250.82,19.7 250.19,19.07 241.3,19.07 240.66,19.7 234.31,19.7 IC42.27 232.41,20.34 231.14,19.07 222.88,19.07 221.62,20.34 RF08A.12 | v259.71,132.09 IC45.27 255.27,132.09 254.63,131.46 250.82,131.46 250.19,130.82 240.66,130.82 240.03,131.46 234.31,131.46 IC39.27 225.43,132.09 224.16,130.82 222.88,130.82 221.62,132.09 RF08B.12
DMA04  (via drill 0.61)  (1 unrouted)
  Top 0.254: v264.16,132.09 264.16,133.36 265.43,134.63 E45.5 | v240.03,130.19 240.03,132.09 242.57,134.63 E39.5 | v262.89,22.88 264.16,22.88 E43.5 | v240.66,18.43 240.66,20.97 242.57,22.88 E42.5
  Bottom 0.254: IC45.5 266.7,129.55 v264.16,132.09 262.89,130.82 251.46,130.82 250.19,129.55 IC39.5 240.66,129.55 v240.03,130.19 239.4,130.82 225.43,130.82 224.16,129.55 RF08B.9 | v262.89,22.88 264.16,21.61 271.78,21.61 272.42,20.97 272.42,18.43 271.14,18.43 IC43.5 269.24,17.8 267.97,19.07 251.46,19.07 250.19,17.8 IC42.5 241.3,17.8 v240.66,18.43 240.03,19.07 232.41,19.07 231.78,18.43 224.79,18.43 224.16,17.8 RF08A.9
DMA05  (via drill 0.61)  (1 unrouted)
  Top 0.254: v247.01,26.69 247.01,24.14 244.47,24.14 E42.6 | v272.42,29.23 272.42,22.24 IC43.6 267.97,22.88 267.97,24.14 266.06,24.14 E43.6 | v240.03,26.69 236.85,23.51 236.85,3.83 232.41,3.83 226.69,9.54 226.69,16.53 223.52,19.7 RF08A.11 | E45.6 267.33,135.9 269.24,135.9 269.24,134.63 IC45.6 | E39.6 244.47,135.9 246.38,135.9 246.38,134.63 IC39.6
  Bottom 0.254: v272.42,29.23 253.37,29.23 250.82,26.69 v247.01,26.69 v240.03,26.69 | IC42.6 250.19,20.34 251.46,21.61 262.89,21.61 264.16,20.34 IC43.6 | RF08B.11 224.16,132.09 224.79,132.73 231.78,132.73 232.41,133.36 236.85,133.36 238.12,132.09 IC39.6 250.19,132.09 251.46,133.36 269.24,133.36 270.51,132.09 IC45.6
DMA06  (via drill 0.61)  (1 unrouted)
  Top 0.254: E43.7 266.06,25.41 268.61,25.41 268.61,24.78 IC43.7 | v241.3,22.88 241.3,24.14 242.57,25.41 E42.7 | E45.7 267.33,137.17 269.88,137.17 269.88,136.54 IC45.7 | E39.7 244.47,137.17 247.01,137.17 247.01,136.54 IC39.7
  Bottom 0.254: RF08A.13 224.16,22.88 225.43,24.14 235.59,24.14 236.85,22.88 v241.3,22.88 IC42.7 252.73,22.88 254,24.14 267.97,24.14 269.24,22.88 IC43.7 | RF08B.13 224.16,134.63 225.43,135.9 235.59,135.9 236.22,135.27 248.28,135.27 IC39.7 254,134.63 255.27,135.9 269.24,135.9 270.51,134.63 IC45.7
DMA07  (via drill 0.61)  (1 unrouted)
  Top 0.254: E43.8 266.06,26.69 269.88,26.69 269.88,26.05 IC43.8 | v245.75,25.41 245.75,26.69 244.47,26.69 E42.8 | E45.8 267.33,138.44 271.14,138.44 271.14,137.81 IC45.8 | E39.8 244.47,138.44 248.28,138.44 248.28,137.81 IC39.8
  Bottom 0.254: RF08A.15 224.16,25.41 224.79,26.05 231.78,26.05 232.41,26.69 238.76,26.69 240.03,25.41 v245.75,25.41 IC42.8 250.82,25.41 252.09,26.69 256.54,26.69 257.18,26.05 268.61,26.05 269.24,25.41 IC43.8 | RF08B.15 224.16,137.17 224.79,137.81 231.78,137.81 232.41,138.44 240.03,138.44 241.3,137.17 IC39.8 250.82,137.17 252.09,138.44 269.24,138.44 270.51,137.17 IC45.8
DMA08  (via drill 0.61)  (1 unrouted)
  Top 0.254: IC42.9 244.47,27.96 E42.9 242.57,27.96 239.4,24.78 239.4,13.99 250.19,3.19 262.89,3.19 262.89,21.61 261.62,22.88 261.62,25.41 264.16,27.96 E43.9 266.06,27.96 IC43.9 | v227.97,40.66 226.06,38.75 226.06,34.3 222.88,34.3 222.25,33.67 222.25,29.86 223.52,28.59 RF08A.17 | E45.9 267.33,139.71 IC45.9 | E39.9 244.47,139.71 IC39.9
  Bottom 0.254: v227.97,40.66 229.24,41.92 245.11,41.92 247.65,44.47 263.52,44.47 268.61,39.38 271.78,39.38 273.69,37.48 273.69,27.96 IC43.9 | RF08B.17 224.16,139.71 225.43,140.98 243.21,140.98 244.47,139.71 IC39.9 250.19,139.71 251.46,140.98 269.24,140.98 270.51,139.71 IC45.9
DMA09  (via drill 0.61)  (1 unrouted)
  Top 0.254: E45.10 267.33,140.98 270.51,140.98 270.51,142.25 IC45.10 | E39.10 244.47,140.98 247.65,140.98 247.65,142.25 IC39.10 | 238.76,29.23 237.49,29.23 v237.49,28.59 | 238.76,29.23 242.57,29.23 E42.10 | v226.06,28.59 224.16,30.5 RF08A.19 | E43.10 266.06,29.23 269.24,29.23 269.24,30.5 IC43.10 | 238.76,29.23 v238.76,40.66
  Bottom 0.254: RF08B.19 231.14,142.25 232.41,143.52 240.03,143.52 240.66,142.89 248.28,142.89 IC39.10 251.46,142.25 252.73,143.52 257.81,143.52 259.08,142.25 IC45.10 | v237.49,28.59 236.85,29.23 226.69,29.23 v226.06,28.59 | IC42.10 250.19,30.5 250.82,31.13 253.37,31.13 254,31.77 258.44,31.77 259.71,30.5 IC43.10 271.14,31.13 272.42,31.13 272.42,36.21 271.78,36.84 269.24,36.84 264.16,41.92 247.65,41.92 247.01,41.29 239.4,41.29 v238.76,40.66
DMA10  (via drill 0.61)  (1 unrouted)
  Top 0.254: v262.89,31.77 262.89,30.5 264.16,30.5 E43.11 | v240.03,33.67 240.03,30.5 242.57,30.5 E42.11 | v264.16,143.52 264.16,142.25 265.43,142.25 E45.11 | v241.3,144.79 241.3,142.25 242.57,142.25 E39.11
  Bottom 0.254: IC43.11 264.16,33.04 v262.89,31.77 261.62,33.04 257.81,33.04 256.54,34.3 251.46,34.3 250.19,33.04 IC42.11 240.66,33.04 v240.03,33.67 239.4,34.3 225.43,34.3 224.16,33.04 RF08A.21 | IC45.11 265.43,144.79 v264.16,143.52 262.89,144.79 259.08,144.79 257.81,146.06 251.46,146.06 250.19,144.79 IC39.11 v241.3,144.79 240.03,146.06 225.43,146.06 224.16,144.79 RF08B.21
DMA11  (via drill 0.61)  (1 unrouted)
  Top 0.254: E45.12 267.33,143.52 269.88,143.52 269.88,145.43 IC45.12 | E39.12 244.47,143.52 247.01,143.52 247.01,145.43 IC39.12 | E43.12 266.06,31.77 268.61,31.77 268.61,33.67 IC43.12 | v245.75,34.3 245.75,31.77 244.47,31.77 E42.12
  Bottom 0.254: RF08B.23 224.16,147.33 225.43,148.6 246.38,148.6 247.65,147.33 IC39.12 250.82,147.33 252.09,148.6 269.24,148.6 270.51,147.33 IC45.12 | RF08A.23 224.16,35.58 224.79,36.21 231.78,36.21 232.41,36.84 243.21,36.84 v245.75,34.3 247.01,35.58 IC42.12 251.46,35.58 252.73,36.84 267.97,36.84 269.24,35.58 IC43.12
GND  (via drill 0.61)  (1 unrouted)
  Top 0.254: RF08A.39 223.52,56.53 226.69,59.7 226.69,73.04 G1.- 234.31,81.93 234.31,83.2 G1.-@1 | G2.-@1 262.25,83.2 262.25,81.93 G2.- 262.25,80.66 262.25,75.58 IC44.7 249.56,62.88 249.56,46.37 IC42.16 | E43.16 266.06,36.84 266.7,37.48 266.7,39.38 269.24,41.92 272.42,41.92 272.42,43.83 IC43.16 | v245.11,43.2 245.11,37.48 244.47,36.84 E42.16 | 239.4,162.57 234.95,167.02 223.52,167.02 | 239.4,162.57 242.57,159.4 242.57,148.6 E39.16 | 223.52,167.02 222.25,165.75 222.25,159.4 223.52,158.13 RF08B.31 | 223.52,167.02 RF08B.39 | E45.16 267.33,148.6 267.97,149.24 267.97,151.14 270.51,153.68 273.69,153.68 273.69,155.59 IC45.16 | G4.-@1 262.25,194.96 262.25,193.69 G4.- 253.37,183.53 253.37,178.45 IC46.7 250.19,175.27 250.19,166.38 | G3.- 234.31,193.69 234.31,194.96 G3.-@1 | 250.19,166.38 250.19,158.76 IC39.16 | 239.4,162.57 243.21,166.38 250.19,166.38
  Bottom 0.254: 246.38,44.47 247.65,45.73 IC42.16 250.19,45.73 251.46,47.01 256.54,47.01 257.18,46.37 268.61,46.37 269.24,45.73 IC43.16 | 246.38,44.47 v245.11,43.2 | 246.38,44.47 232.41,44.47 231.78,45.1 224.79,45.1 224.16,45.73 RF08A.31 | G1.-@1 235.59,83.2 262.25,83.2 G2.-@1 | G3.- 250.19,177.81 IC46.7 | IC45.16 270.51,157.49 269.88,158.13 258.44,158.13 257.81,158.76 251.46,158.76 250.19,157.49 IC39.16
MEMSUPPLY  (1 unrouted)
  Top 0.508: E42.32 231.78,17.8 231.78,9.54 IC42.32 | D1.C 233.04,5.73 233.04,7 IC42.32 | E43.32 251.46,17.8 R3.2 | D2.C 236.22,10.18 IC42.32 | E39.32 231.78,129.55 231.78,121.3 IC39.32 233.04,118.76 233.04,117.49 D6.C 236.22,116.86 | 254,119.39 254,129.55 E45.32 | 254,119.39 R4.2 236.22,116.86 | 254,119.39 IC45.32 | 236.22,116.86 D5.C
  Bottom 0.508: D2.C 238.76,50.81 IC44.14 246.38,50.81 247.65,49.55 262.89,49.55 D3.C | IC43.32 252.73,5.09 R3.2 D1.C | D5.C 238.76,162.57 IC46.14 246.38,162.57 247.65,161.3 262.89,161.3 D7.C
N$1
  Top 0.254: E43.19 253.37,34.3 256.54,34.3 257.18,34.94 257.18,38.75 IC43.19
N$2  (via drill 0.61)
  Top 0.254: v247.01,36.84 247.01,34.3 250.19,34.3 250.82,33.67 250.82,33.04 251.46,33.04 E43.20
  Bottom 0.254: v247.01,36.84 251.46,36.84 252.73,38.12 IC43.20
N$3  (via drill 0.61)
  Top 0.254: v257.81,34.3 257.81,31.77 253.37,31.77 E43.21
  Bottom 0.254: v257.81,34.3 256.54,35.58 IC43.21
N$4
  Top 0.254: E45.19 254.63,146.06 257.81,146.06 258.44,146.7 258.44,150.51 IC45.19
N$5  (via drill 0.61)
  Top 0.254: v250.82,148.6 250.82,144.79 252.73,144.79 E45.20
  Bottom 0.254: v250.82,148.6 252.09,149.88 IC45.20
N$6  (via drill 0.61)
  Top 0.254: v259.08,146.06 259.08,143.52 254.63,143.52 E45.21
  Bottom 0.254: v259.08,146.06 257.81,147.33 IC45.21
N$18
  Top 0.254: IC44.3 250.82,57.8 250.82,59.07 IC44.5 252.09,61.61 252.09,62.88 IC44.6
N$35
  Top 0.254: IC44.1 252.09,51.45 252.09,52.72 IC44.2
  Bottom 0.254: JP1.2 233.68,54.62 250.19,54.62 251.46,53.36 IC44.2
N$36
  Top 0.254: D7.A G4.+@1 267.33,173.37 267.33,174.64 G4.+@2 | G4.+ 258.44,173.37 258.44,174.64 G4.+@3
  Bottom 0.254: G4.+ 260.35,174 261.62,174 G4.+@4 264.16,174 265.43,174 G4.+@1
N$38
  Top 0.254: IC46.3 250.82,169.56 250.82,170.83 IC46.5 252.09,173.37 252.09,174.64 IC46.6
N$39
  Top 0.254: IC46.1 252.09,163.21 252.09,164.48 IC46.2
  Bottom 0.254: JP2.2 233.68,166.38 250.19,166.38 251.46,165.11 IC46.2
N$41
  Top 0.254: D5.A G3.+@1 239.4,173.37 239.4,174.64 G3.+@2 | G3.+ 230.5,173.37 230.5,174.64 G3.+@3
  Bottom 0.254: G3.+ 232.41,174 233.68,174 G3.+@4 236.22,174 237.49,174 G3.+@1
N$130
  Top 0.254: D3.A G2.+@1 267.33,61.61 267.33,62.88 G2.+@2 | G2.+ 258.44,61.61 258.44,62.88 G2.+@3
  Bottom 0.254: G2.+ 260.35,62.24 261.62,62.24 G2.+@4 264.16,62.24 265.43,62.24 G2.+@1
N$131
  Top 0.254: D2.A G1.+@1 239.4,61.61 239.4,62.88 G1.+@2 | G1.+ 230.5,61.61 230.5,62.88 G1.+@3
  Bottom 0.254: G1.+ 232.41,62.24 233.68,62.24 G1.+@4 236.22,62.24 237.49,62.24 G1.+@1
VCC  (1 unrouted)
  Top 0.508: D6.A 222.25,116.86 220.98,118.12 RF08B.2 | D1.A 222.25,5.09 220.98,6.36 RF08A.2
WRITING  (via drill 0.61)  (1 unrouted)
  Top 0.254: E43.24 253.37,27.96 IC43.24 | E42.24 231.78,27.96 IC42.24 | v229.24,3.83 224.16,8.91 219.71,8.91 219.71,26.05 220.98,27.32 RF08A.18 | E45.24 254.63,139.71 IC45.24 260.99,135.27 260.99,121.3 255.27,115.58 225.43,115.58 225.43,121.94 224.16,123.2 219.71,123.2 219.71,137.81 220.98,139.08 RF08B.18 | E39.24 231.78,139.71 IC39.24
  Bottom 0.254: RF08A.18 221.62,27.96 222.88,26.69 231.14,26.69 232.41,27.96 IC42.24 | v229.24,3.83 269.24,3.83 272.42,7 273.05,7 273.05,25.41 271.78,26.69 257.81,26.69 256.54,27.96 IC43.24 | RF08B.18 221.62,139.71 222.88,138.44 231.14,138.44 232.41,139.71 IC39.24

### Text on the board
Bottom: RS08 | VRS | RF08 Debug | VRS | RS08 | VRS | RF08 | VRS
tPlace: RF08 | VRS
tValues: RF08 Debug | VRS | RS08 | VRS | RS08 | VRS